# Altium schematic sheet tmp.SchDoc
size 594 x 420 mm; Address1: Address1; Address2: Address2; Address3: Address3; Address4: Address4; SheetNumber: 1; Scale: 1:1; Разраб.: Иванов; Обозначение документа: АБВГ.123456.001 Э3; Пров.: Петров; Утв.: Сидоров; Наименование организации: ОАО "Концерн "МПО-Гидроприбор"; Перв. применение: АБВГ.123456.000; Наименование изделия 1: Плата; Наименование изделия 2: Схема электрическая; Наименование изделия 3: принципиальная; Нач. отд.: Нач. отд.; Фамилия нач. отд.: Сидоров
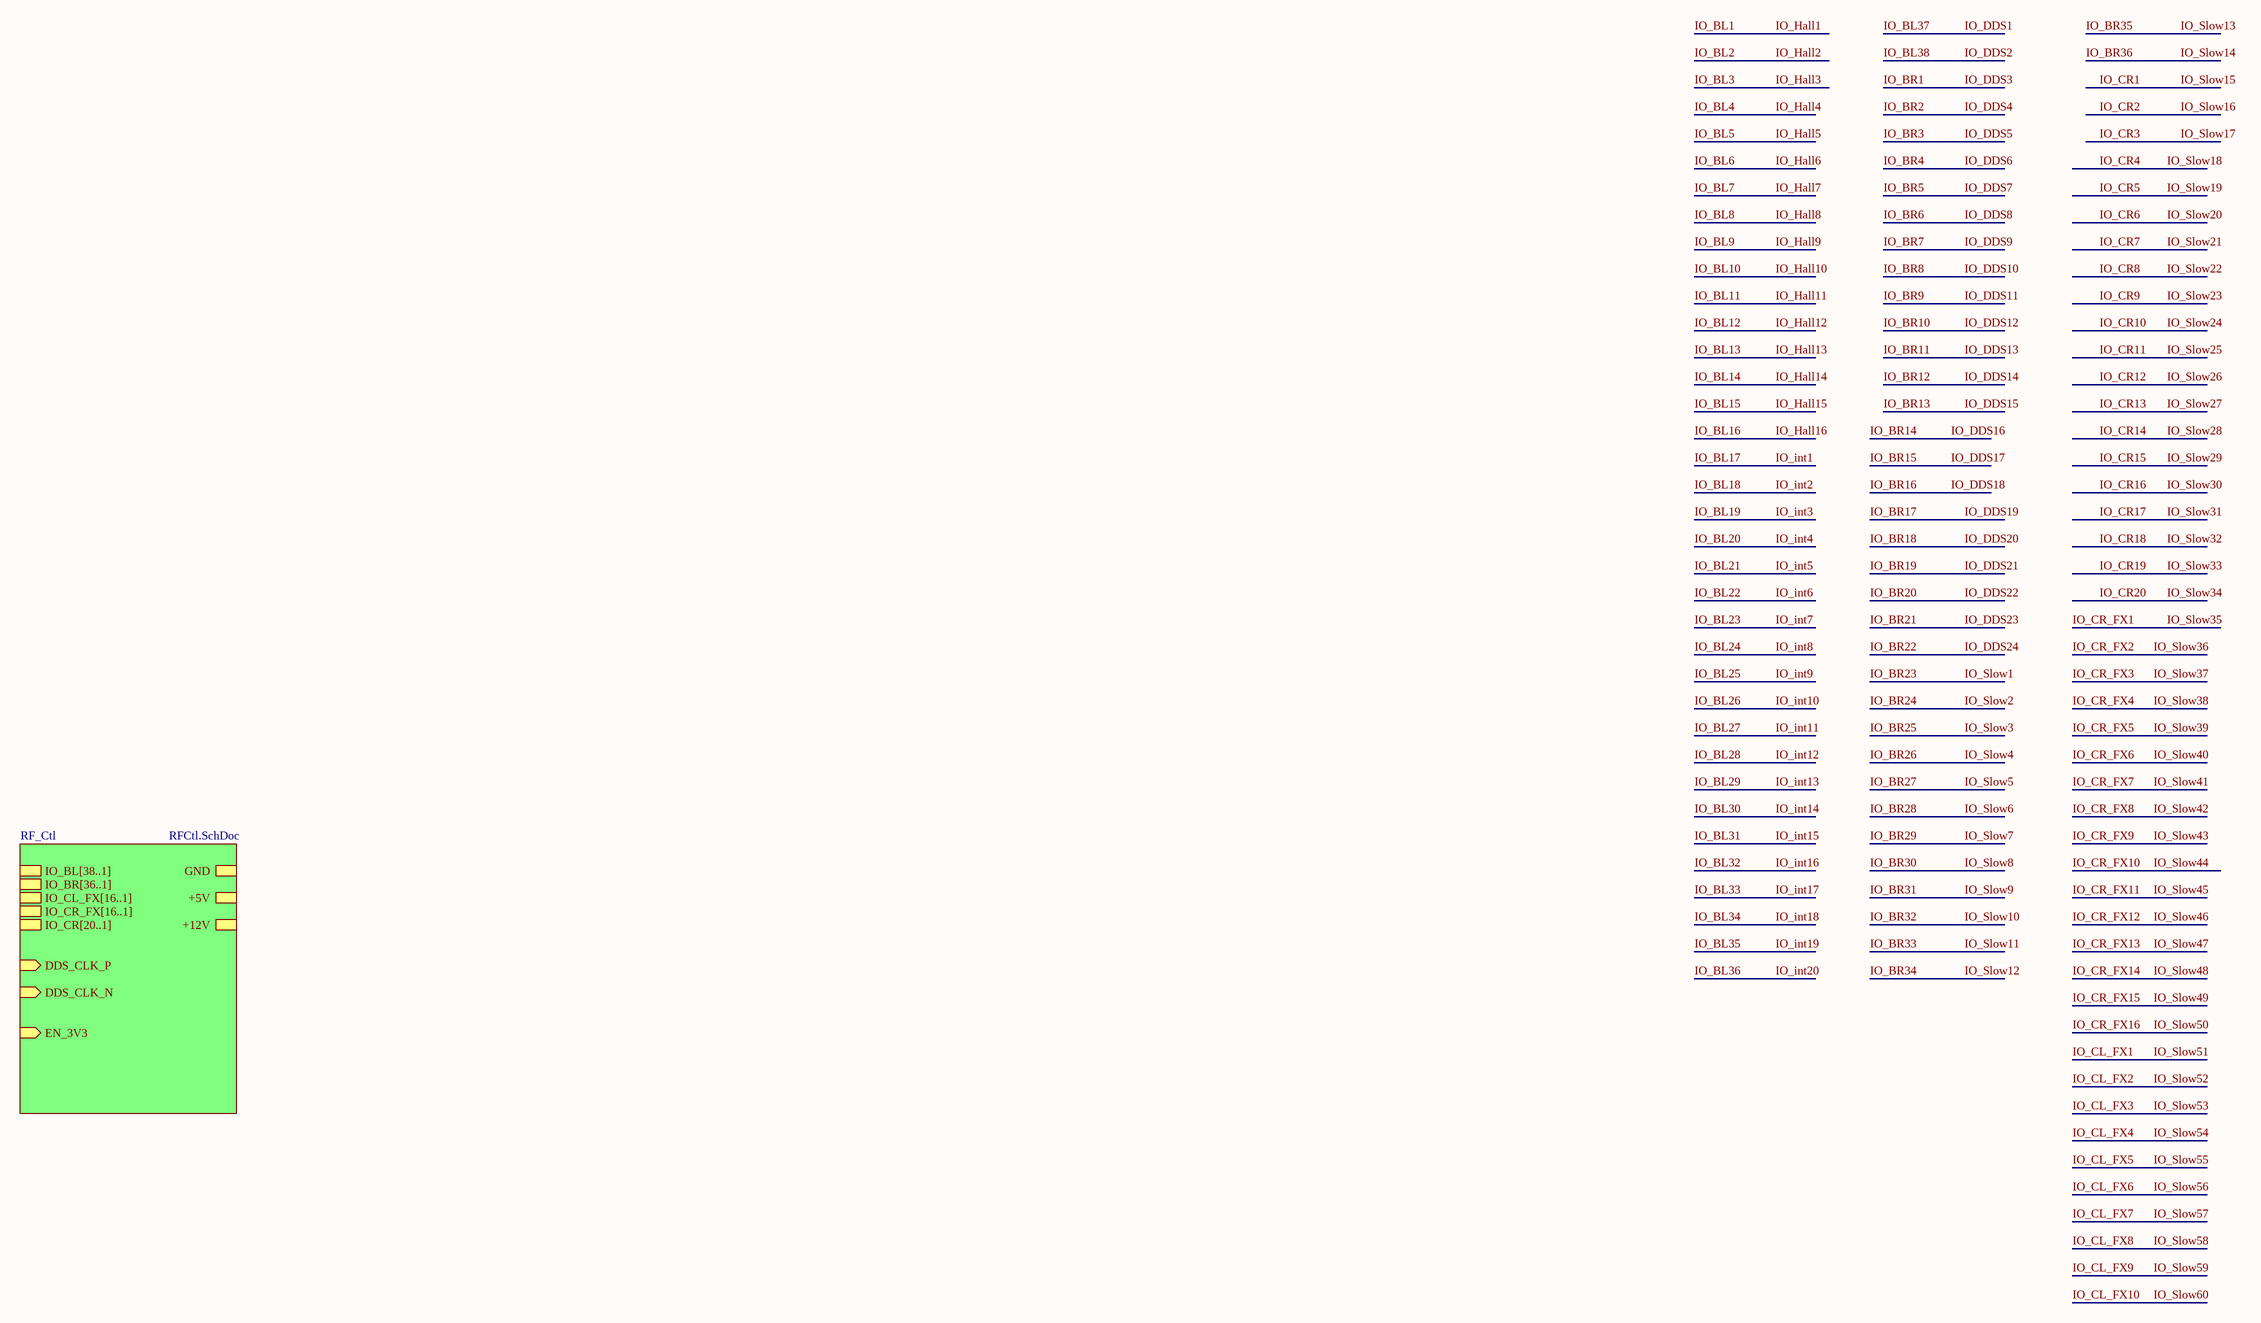
[diagram p0: tmp.SchDoc]

## Sub-sheets
RF_Ctl = RFCtl.SchDoc: IO_CR[20..1], IO_BL[38..1], IO_BR[36..1], IO_CL_FX[16..1], IO_CR_FX[16..1], DDS_CLK_P (in), DDS_CLK_N (in), EN_3V3 (in), GND, +5V, +12V

## Notes on the sheet
- Подп. и дата
- Инв. № дубл.
- Взам. инв. №
- Инв. № подл.
- Изм.
- Лист
- № докум.
- Подп.
- Дата
- Копировал
- Формат А2